# EAGLE design voice-rev.03 (EAGLE 6.5.0)
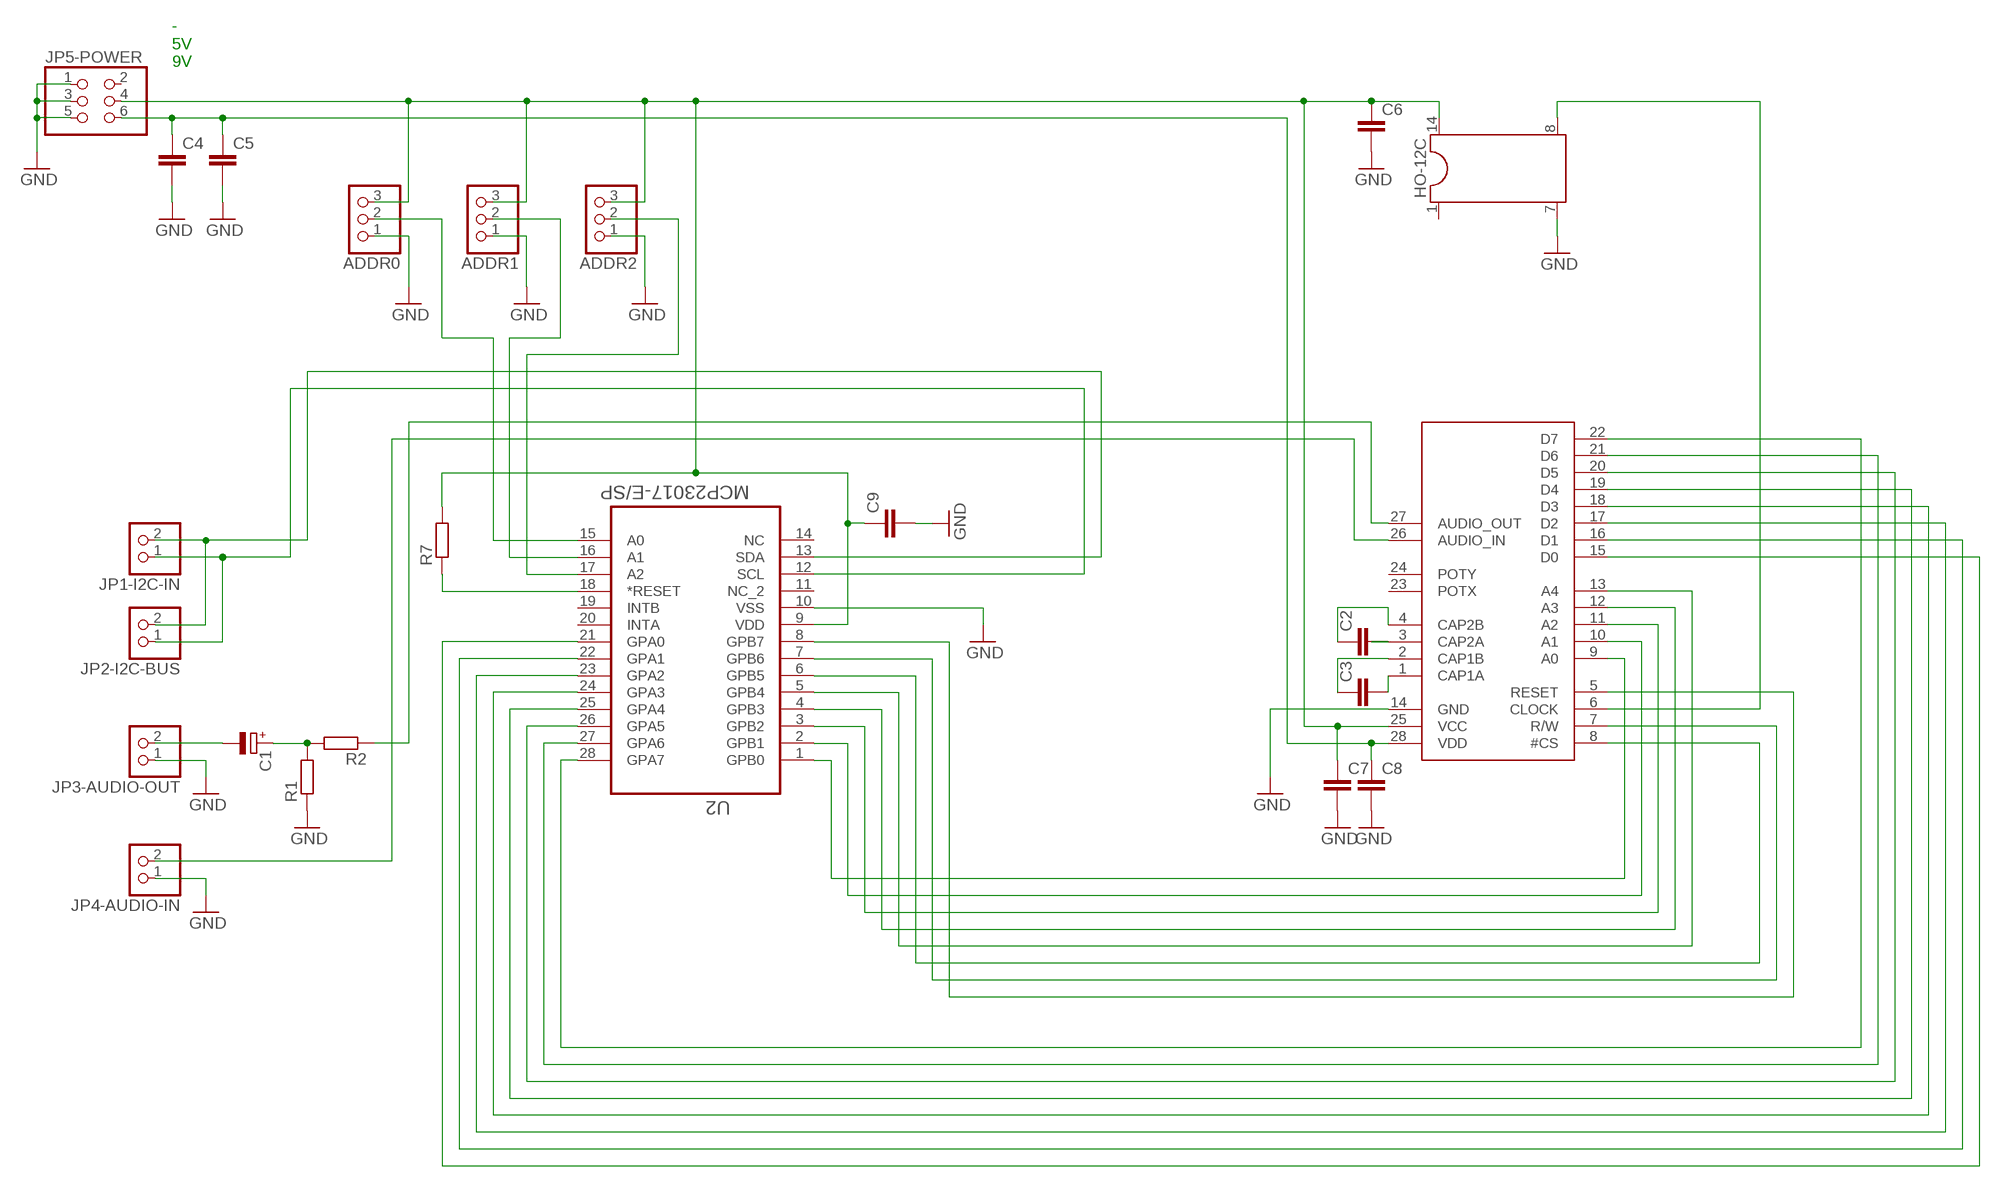
[diagram p0: schematic, sheet 1]

## Parts
ADDR0  PINHD-1X3  [1X03]
ADDR1  PINHD-1X3  [1X03]
ADDR2  PINHD-1X3  [1X03]
C1  CPOL-EUE2.5-5  [E2,5-5]
C2  C5/2.5  [C5B2.5]
C3  C5/2.5  [C5B2.5]
C4  C-EU050-024X044  [C050-024X044]
C5  C-EU050-024X044  [C050-024X044]
C6  C-EU050-024X044  [C050-024X044]
C7  C-EU050-024X044  [C050-024X044]
C8  C-EU050-024X044  [C050-024X044]
C9  C-EU050-024X044  [C050-024X044]
HO-12C  DIL14/4  [DIL14/4]
JP1-I2C-IN  PINHD-1X2  [1X02]
JP2-I2C-BUS  PINHD-1X2  [1X02]
JP3-AUDIO-OUT  PINHD-1X2  [1X02]
JP4-AUDIO-IN  PINHD-1X2  [1X02]
JP5-POWER  PINHD-2X3  [2X03]
R1  R-EU_0207/5V  [0207/5V]
R2  R-EU_0207/5V  [0207/5V]
R7  R-EU_0207/5V  [0207/5V]
U2  MCP23017-E/SP  [DIP254P762X406-28P]
U$1  6581  [DIL28-6]

## Nets
GND: ADDR0.1 ADDR1.1 ADDR2.1 C4.2 C5.2 C6.2 C7.2 C8.2 C9.2 HO-12C.7 JP3-AUDIO-OUT.1 JP4-AUDIO-IN.1 JP5-POWER.1 JP5-POWER.3 JP5-POWER.5 R1.1 U2.10(VSS) U$1.14(GND)
N$1: U2.1(GPB0) U$1.9(A0)
N$2: U2.2(GPB1) U$1.10(A1)
N$3: U2.3(GPB2) U$1.11(A2)
N$4: U2.4(GPB3) U$1.12(A3)
N$5: U2.5(GPB4) U$1.13(A4)
N$6: U2.6(GPB5) U$1.8(#CS)
N$7: U2.7(GPB6) U$1.7(R/W)
N$8: U2.8(GPB7) U$1.5(RESET)
N$9: U2.28(GPA7) U$1.22(D7)
N$10: U2.27(GPA6) U$1.21(D6)
N$11: U2.26(GPA5) U$1.20(D5)
N$12: U2.25(GPA4) U$1.19(D4)
N$13: U2.24(GPA3) U$1.18(D3)
N$14: U2.23(GPA2) U$1.17(D2)
N$15: U2.22(GPA1) U$1.16(D1)
N$16: U2.21(GPA0) U$1.15(D0)
N$17: HO-12C.8 U$1.6(CLOCK)
N$18: C1.+ R1.2 R2.2
N$20: C4.1 C5.1 C8.1 JP5-POWER.6 U$1.28(VDD)
N$21: R2.1 U$1.27(AUDIO_OUT)
N$22: JP4-AUDIO-IN.2 U$1.26(AUDIO_IN)
N$25: JP1-I2C-IN.2 JP2-I2C-BUS.2 U2.13(SDA)
N$26: JP1-I2C-IN.1 JP2-I2C-BUS.1 U2.12(SCL)
N$27: C1.- JP3-AUDIO-OUT.2
N$28: C3.2 U$1.1(CAP1A)
N$29: C3.1 U$1.2(CAP1B)
N$30: C2.2 U$1.3(CAP2A)
N$31: C2.1 U$1.4(CAP2B)
N$32: ADDR0.2 U2.15(A0)
N$33: ADDR1.2 U2.16(A1)
N$34: ADDR2.2 U2.17(A2)
N$36: R7.1 U2.18(*RESET)
N$39: ADDR0.3 ADDR1.3 ADDR2.3 C6.1 C7.1 C9.1 HO-12C.14 JP5-POWER.4 R7.2 U2.9(VDD) U$1.25(VCC)
Unconnected: HO-12C.1 JP5-POWER.2 U2.11(NC_2) U2.14(NC) U2.19(INTB) U2.20(INTA) U$1.23(POTX) U$1.24(POTY)

## Notes on the sheet
- -
  5V
  9V

## Library data of the parts
ADDR0 ADDR1 ADDR2 = pinhead:PINHD-1X3: PIN HEADER
C1 = resistor:CPOL-EU: POLARIZED CAPACITOR, European symbol
C2 C3 = capacitor-wima:C: CAPACITOR naming: grid - package width
C4-C9 = resistor:C-EU: CAPACITOR, European symbol
HO-12C = ic-package:DIL14/4: Dual In Line / Socket
JP1-I2C-IN JP2-I2C-BUS JP3-AUDIO-OUT JP4-AUDIO-IN = pinhead:PINHD-1X2: PIN HEADER
JP5-POWER = pinhead:PINHD-2X3: PIN HEADER
R1 R2 R7 = resistor:R-EU_: RESISTOR, European symbol
U2 = mcp23017-e-sp:MCP23017-E/SP: IC, 16-Bit I/O Expander with Serial Interface, DIP-28; MPN: MCP23017-E/SP; OC_FARNELL: 1332088; OC_NEWARK: 31K2959; PACKAGE: DIP-28; SUPPLIER: Microchip
U$1 = Mos6581_sid:6581: The Famous C64 Sound Chip - MOS6581

## Board
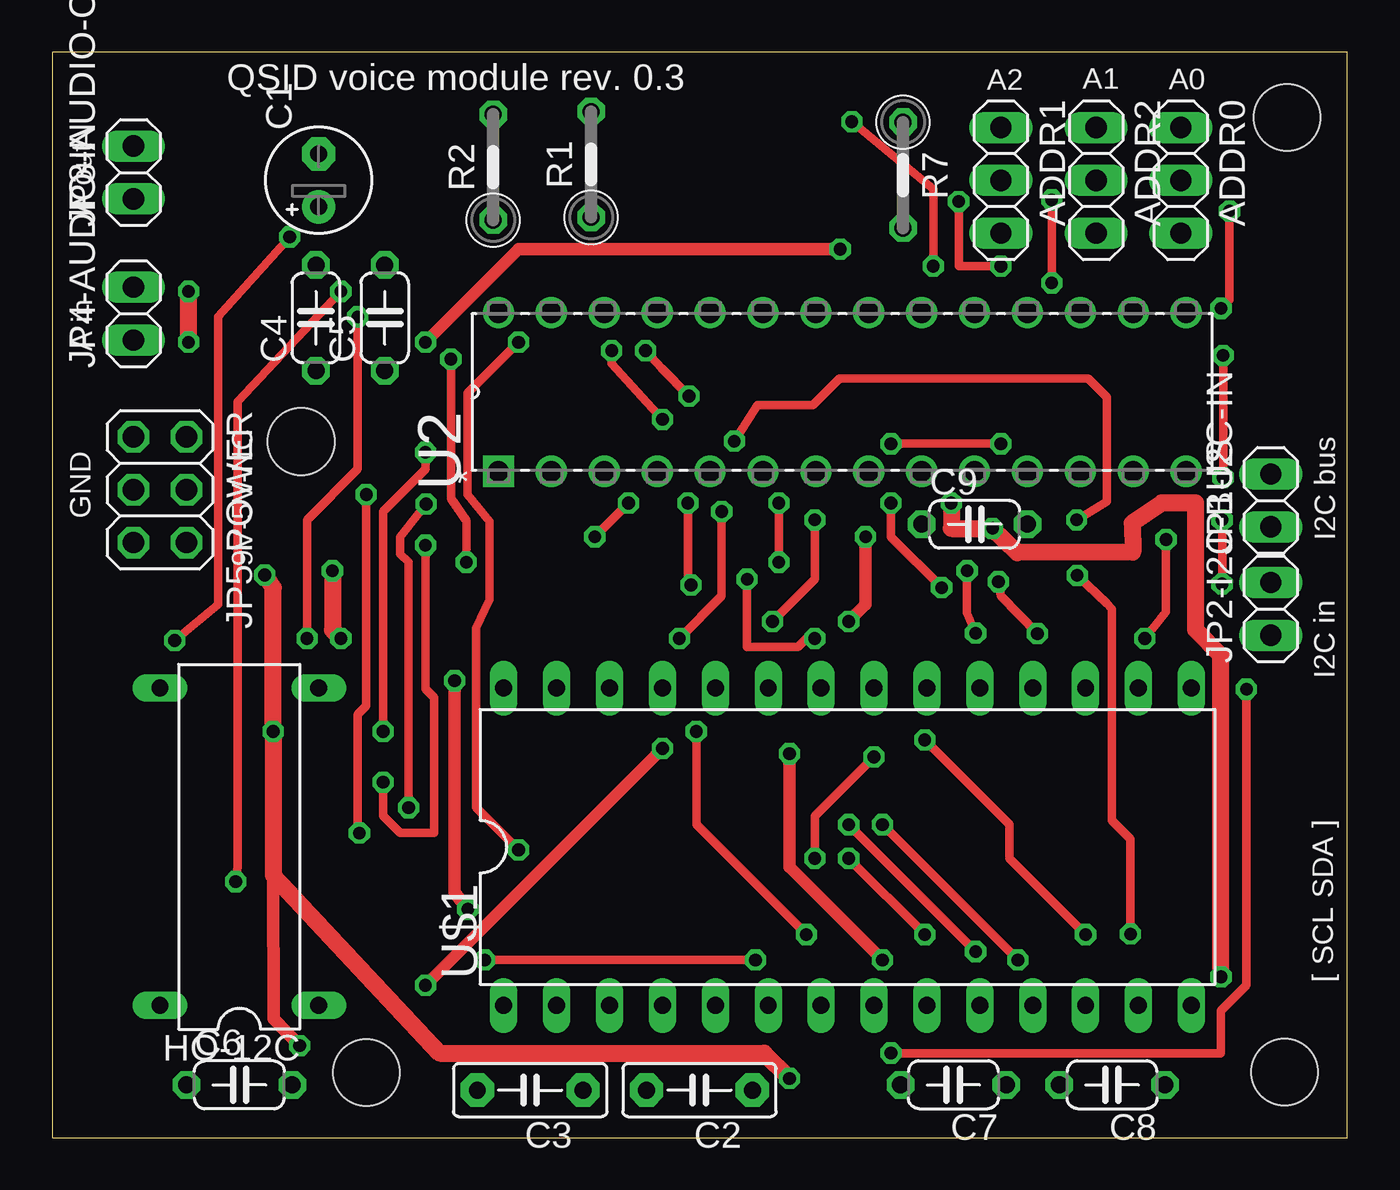
[diagram p1: board, top side]
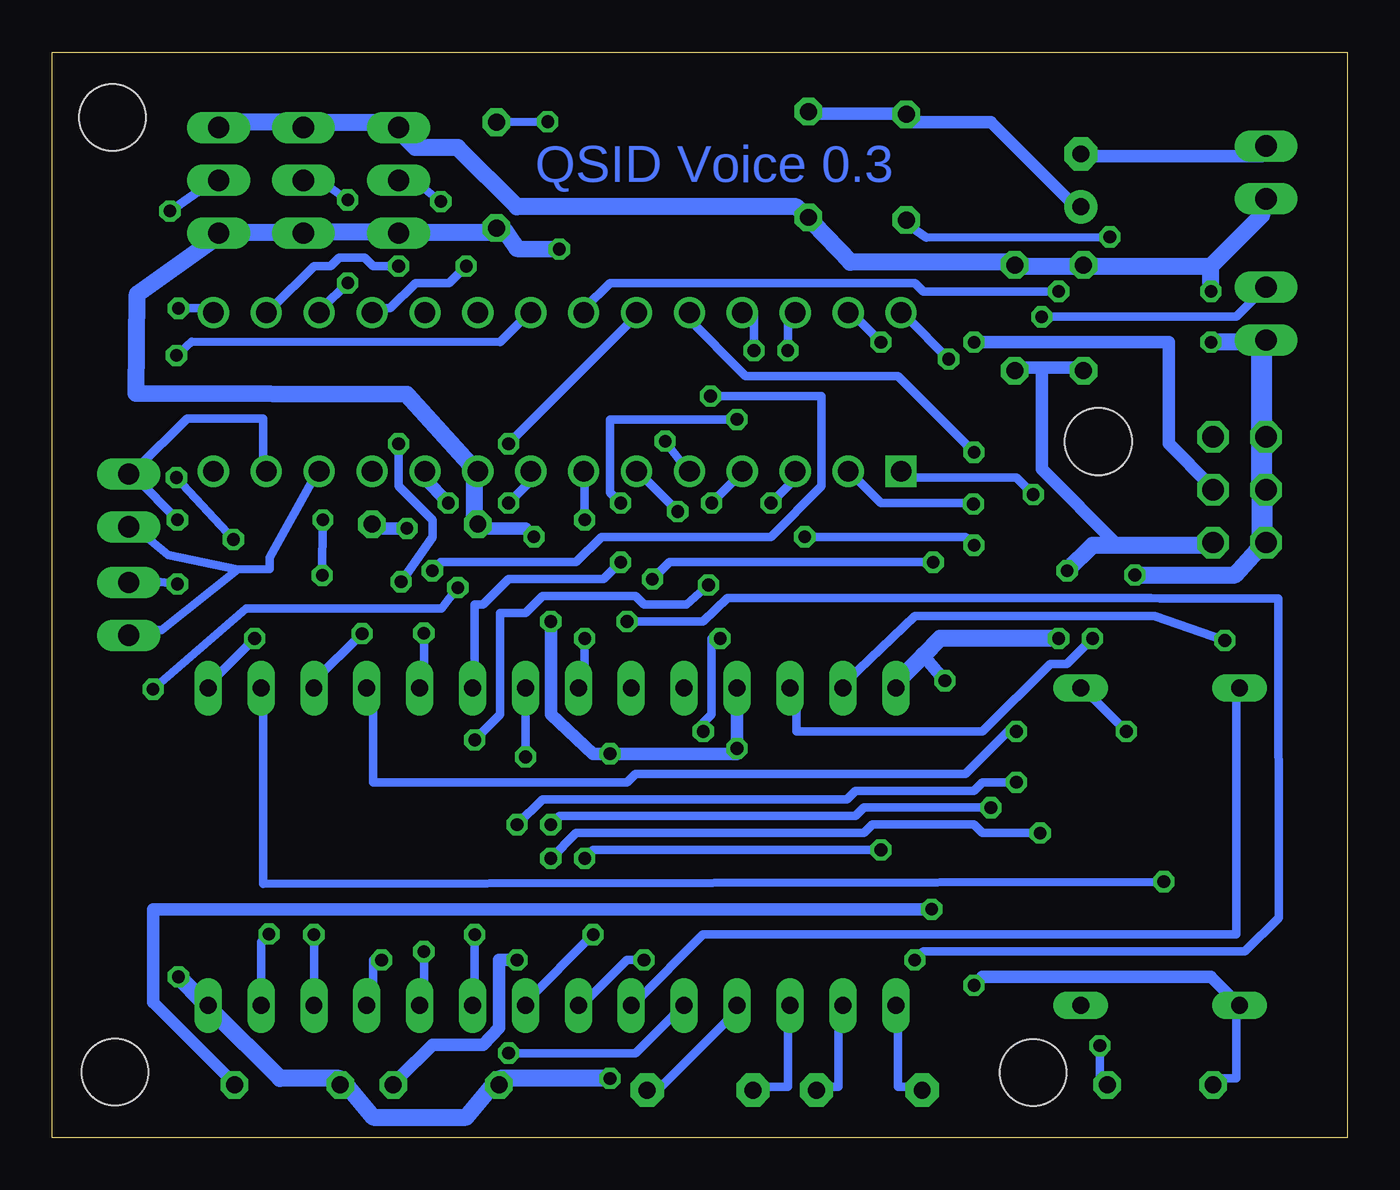
[diagram p2: board, bottom side, seen from below]

Size 62.2 x 52.14 mm. Coordinates in mm from the lower left corner, seen from the top.
Outline: 0,0 62.2,0 62.2,52.14 0,52.14 0,0
Copper layers (1*16): Top 0.035mm / dielectric 1.5mm / Bottom 0.035mm
Design rules "default *": minimum track width 16mil, minimum drill 24mil, track to track 12mil, track to pad 12mil, pad to pad 12mil, via to via 12mil, smd to smd 8mil, copper to edge 40mil, drill to drill 8mil, minimum pad ring 10mil, minimum via ring 8mil, stop-mask expansion 4mil, vias tented up to drill 0mil, thermal gap 10mil
Holes 3.2 mm at 15.09,3.12 11.96,33.43 59.31,49 59.18,3.15
tRestrict: area 43.8,47.8 to 47.3,49.3; area 40.1,47.8 to 41.9,49.8; area 40,42.4 to 42,44.7; area 3.7,20.3 to 7,22.9; area 11.3,20.6 to 14.6,22.9; area 3.4,5.1 to 7.2,7.4; area 11.3,5.3 to 14.3,7.1; area 5.4,1.5 to 7.5,3.6; area 10.5,1.5 to 12.5,3.6; area 39.5,1.3 to 41.8,3.6; area 44.8,1.5 to 46.8,3.6; area 47.3,1.5 to 49.4,3.6; 40 more areas

### Footprints (pad centres in the part's own frame; a part is rotated, then mirrored left to right if it is on the bottom)
1X03 = drill 1.016 long: 1 -2.54,0; 2 0,0; 3 2.54,0
E2,5-5 = drill 0.813 pad 1.6: + -1.27,0 | drill 0.813 pad 1.6 octagon: - 1.27,0
C5B2.5 = drill 0.813 pad 1.6 octagon: 1 -2.54,0; 2 2.54,0
C050-024X044 = drill 0.813 octagon: 1 -2.54,0; 2 2.54,0
DIL14/4 = drill 0.813 long: 1 -7.62,-3.81; 7 7.62,-3.81; 8 7.62,3.81; 14 -7.62,3.81
1X02 = drill 1.016 long: 1 -1.27,0; 2 1.27,0
2X03 = drill 1.016 octagon: 1 -2.54,-1.27; 2 -2.54,1.27; 3 0,-1.27; 4 0,1.27; 5 2.54,-1.27; 6 2.54,1.27
0207/5V = drill 0.813 octagon: 1 -2.54,0; 2 2.54,0
DIP254P762X406-28P = drill 0.991 square: 1 -7.62,33.02 | drill 0.991: 2 -7.62,30.48; 3 -7.62,27.94; 4 -7.62,25.4; 5 -7.62,22.86; 6 -7.62,20.32; 7 -7.62,17.78; 8 -7.62,15.24; 9 -7.62,12.7; 10 -7.62,10.16; 11 -7.62,7.62; 12 -7.62,5.08; 13 -7.62,2.54; 14 -7.62,0; 15 0,0; 16 0,2.54; 17 0,5.08; 18 0,7.62; 19 0,10.16; 20 0,12.7; 21 0,15.24; 22 0,17.78; 23 0,20.32; 24 0,22.86; 25 0,25.4; 26 0,27.94; 27 0,30.48; 28 0,33.02
DIL28-6 = drill 0.813 long: 1 -16.51,-7.62; 2 -13.97,-7.62; 3 -11.43,-7.62; 4 -8.89,-7.62; 5 -6.35,-7.62; 6 -3.81,-7.62; 7 -1.27,-7.62; 8 1.27,-7.62; 9 3.81,-7.62; 10 6.35,-7.62; 11 8.89,-7.62; 12 11.43,-7.62; 13 13.97,-7.62; 14 16.51,-7.62; 15 16.51,7.62; 16 13.97,7.62; 17 11.43,7.62; 18 8.89,7.62; 19 6.35,7.62; 20 3.81,7.62; 21 1.27,7.62; 22 -1.27,7.62; 23 -3.81,7.62; 24 -6.35,7.62; 25 -8.89,7.62; 26 -11.43,7.62; 27 -13.97,7.62; 28 -16.51,7.62

### Placement (x,y rotation side)
ADDR0  54.2,45.97 270 top
ADDR1  45.57,45.97 270 top
ADDR2  50.14,45.97 270 top
C1  12.8,45.97 90 top
C2  31.09,2.29 180 top
C3  22.96,2.29 180 top
C4  12.67,39.37 90 top
C5  15.98,39.37 90 top
C6  8.99,2.54 0 top
C7  43.28,2.54 180 top
C8  50.9,2.54 180 top
C9  44.3,29.46 0 top
HO-12C  8.99,13.97 90 top
JP1-I2C-IN  58.52,30.61 90 top
JP2-I2C-BUS  58.52,25.4 90 top
JP3-AUDIO-OUT  3.91,46.35 90 top
JP4-AUDIO-IN  3.91,39.57 90 top
JP5-POWER  5.18,31.11 270 top
R1  25.88,46.74 90 top
R2  21.18,46.61 90 top
R7  40.87,46.23 270 top
U2  54.46,39.62 90 top
U$1  38.2,13.97 0 top

### Tracks (layer width: path | path; a pad name or v marks a point on that pad's centre or on a via)
GND  (via drill 0.61)
  Top 0.61: v11.89,4.42 10.64,5.71 10.62,12.6
  Top 0.813: v43.18,30.48 43.18,29.26 v45.16,29.26 46.35,28.09 51.89,28.12 51.87,29.52 53.29,30.48 54.91,30.48 54.91,24.38 56.13,23.16 v56.13,7.72 | v10.21,27.03 10.62,26.42 v10.62,19.51 10.62,12.6 18.62,4.06 34.19,4.06 v35.41,2.85 | v6.55,38.2 v6.55,40.64
  Bottom 0.406: 45.57,48.77 ADDR1.1 45.57,48.36 | 50.44,48.77 ADDR2.1 | 13.06,41.86 C4.2 12.65,41.86 | 15.9,41.86 C5.2 16.15,42.04 | 26.06,44.3 R1.1 | 46.79,29.26 C9.2 | 44.35,31.7 U2.10 | 48.01,2.44 C8.2 48.41,2.85 | 54.51,6.1 U$1.14 | 4.11,28.85 JP5-POWER.5 | 4.11,30.89 JP5-POWER.3 4.11,31.29 | 4.11,33.33 JP5-POWER.1 4.11,33.73 | 4.11,37.8 JP4-AUDIO-IN.1 | v11.89,4.42 11.89,2.79 C6.2 | v10.62,19.51 12.65,21.54 HO-12C.7
  Bottom 0.61: v45.16,29.26 46.79,29.26 | 44.35,31.7 v43.18,30.48 | 41.1,2.44 C7.2 40.69,2.85 | 54.91,6.5 U$1.14
  Bottom 0.813: 45.57,48.77 50.04,48.77 ADDR2.1 | 50.44,48.77 54.1,48.77 ADDR0.1 | 15.9,41.86 13.06,41.86 | 16.15,42.04 23.88,42.04 25.65,43.89 R1.1 | 6.55,41.86 4.11,44.3 JP3-AUDIO-OUT.1 | 12.65,41.86 6.55,41.86 | 45.57,48.36 44.75,47.55 42.72,47.55 39.88,44.7 26.47,44.7 26.06,44.3 | 41.1,2.44 42.32,0.99 46.79,0.99 48.01,2.44 | 54.51,6.1 51.26,2.85 48.41,2.85 | 54.91,6.5 v56.13,7.72 | v10.21,27.03 5.38,27.03 4.11,28.45 JP5-POWER.5 | v35.41,2.85 40.69,2.85 | v6.55,40.64 6.55,41.86 | v6.55,38.2 4.11,38.2 JP4-AUDIO-IN.1
  Bottom 1.016: 4.11,30.89 4.11,28.85 | 4.11,31.29 4.11,33.33 | 4.11,33.73 4.11,37.8
N$1  (via drill 0.61)
  Top 0.406: v38.25,13.41 v41.91,9.75 | v14.76,14.63 14.68,15.04 14.68,20.32 15.09,20.73 v15.09,30.89
  Bottom 0.406: v41.91,9.75 41.91,6.5 U$1.9 | v38.25,13.41 37.03,14.63 23.22,14.63 22.81,15.04 17.93,15.04 17.53,14.63 v14.76,14.63 | v15.09,30.89 15.9,31.7 21.18,31.7 U2.1
N$2  (via drill 0.61)
  Top 0.406: v38.25,15.04 v44.35,8.94 | v17.12,15.85 17.12,27.64 16.71,28.04 16.71,28.85 v17.96,30.43
  Bottom 0.406: v44.35,8.94 44.35,6.5 U$1.10 | v38.25,15.04 37.85,15.44 23.62,15.44 23.22,15.85 v17.12,15.85 | v17.96,30.43 18.34,30.48 22.4,30.48 23.62,31.7 U2.2
N$3  (via drill 0.61)
  Top 0.406: v39.88,15.04 v46.38,8.53 | v15.9,17.07 15.9,15.44 16.71,14.63 18.34,14.63 18.34,21.13 17.93,21.54 v17.93,28.45 | v27.69,30.48 v26.06,28.85
  Bottom 0.406: v46.38,8.53 46.79,8.53 46.79,6.5 U$1.11 | v39.88,15.04 38.66,16.26 24.03,16.26 23.62,16.66 17.93,16.66 17.53,17.07 v15.9,17.07 | v17.93,28.45 18.34,28.85 v26.06,28.85 | v27.69,30.48 26.47,31.7 U2.3
N$4  (via drill 0.61)
  Top 0.406: v49.63,9.75 45.97,13.41 45.97,15.04 v41.91,19.1 | v30.68,26.54 30.53,26.82 v30.53,30.48
  Bottom 0.406: v49.63,9.75 U$1.12 | v41.91,19.1 40.69,20.32 40.69,25.2 39.47,25.2 38.66,26.01 34.19,26.01 33.78,25.6 31.75,25.6 v30.68,26.54 | v30.53,30.48 29.31,31.7 U2.4
N$5  (via drill 0.6)
  Top 0.406: v32.77,33.45 33.88,35.18 36.55,35.18 37.82,36.45 49.76,36.45 50.65,35.56 50.65,30.56 v49.2,29.67 | v51.79,9.78 51.79,14.35 50.9,15.24 50.9,25.4 50.65,25.65 v49.23,27
  Bottom 0.406: U2.5 31.85,32.26 v32.77,33.45 | v51.79,9.78 52.17,9.4 U$1.13 | v49.2,29.67 v49.23,27
N$6  (via drill 0.61)
  Top 0.406: v36.22,9.75 30.94,15.04 v30.94,19.51 | v30.12,23.98 32.16,26.01 v32.16,30.07
  Bottom 0.406: v36.22,9.75 39.47,6.5 U$1.8 | v30.94,19.51 30.94,19.91 30.53,20.32 30.53,23.98 v30.12,23.98 | v32.16,30.07 33.78,31.7 U2.6
N$7  (via drill 0.61)
  Top 0.406: v20.78,8.53 v33.78,8.53 | v34.59,24.79 36.63,26.82 v36.63,29.67
  Bottom 0.406: v33.78,8.53 34.59,8.53 36.63,6.5 U$1.7 | v20.78,8.53 20.37,8.94 4.93,8.94 3.3,10.57 3.33,25.88 9.02,25.88 9.45,25.91 29.77,25.91 30.94,24.79 v34.59,24.79 | v36.63,29.67 36.63,31.7 U2.7
N$8  (via drill 0.61)
  Top 0.406: v40.28,4.06 56.13,4.06 56.13,6.1 57.35,7.32 v57.35,21.54 | v42.72,26.42 40.28,28.85 v40.28,30.48
  Bottom 0.406: v40.28,4.06 34.19,4.06 32.16,6.1 U$1.5 | v57.35,21.54 52.88,25.43 43.51,25.43 v42.72,26.42 | v40.28,30.48 39.07,31.7 U2.8
N$9  (via drill 0.61)
  Top 0.406: v36.63,23.98 36.22,23.98 35.81,23.57 33.38,23.57 v33.38,26.82 | v19.15,37.39 19.15,30.68 19.91,29.62 19.91,28.75 v19.89,27.64
  Bottom 0.406: v36.63,23.98 36.63,21.95 U$1.22 | v33.38,26.82 32.56,27.64 v19.89,27.64 | v19.15,37.39 21.18,39.42 U2.28
N$10  (via drill 0.61)
  Top 0.406: v39.47,18.29 36.63,15.44 v36.63,13.41 | v22.4,13.82 20.37,15.85 20.37,24.49 21.01,25.86 21.01,29.59 19.96,30.89 19.96,35.76 v22.4,38.2
  Bottom 0.406: v39.47,18.29 U$1.21 | v36.63,13.41 36.22,13.82 v22.4,13.82 | v22.4,38.2 23.62,39.42 U2.27
N$11  (via drill 0.61)
  Top 0.406: v34.9,30.48 v34.9,27.64 | v29.31,34.49 26.87,37.19 v26.87,37.8
  Bottom 0.406: v34.9,27.64 35.71,26.82 40.28,26.82 41.5,25.6 41.91,25.6 41.91,21.95 U$1.20 | v34.9,30.48 35.41,30.99 35.41,34.49 v29.31,34.49 | v26.87,37.8 26.87,39.42 U2.26
N$12  (via drill 0.61)
  Top 0.406: v44.35,24.23 43.94,25.2 v43.94,27.23 | v30.58,35.61 29.26,36.96 v28.5,37.8
  Bottom 0.406: v44.35,24.23 44.35,21.95 U$1.19 | v43.94,27.23 43.54,27.64 37.03,27.64 35.81,28.85 27.69,28.85 25.25,31.29 25.25,35.61 v30.58,35.61 | v28.5,37.8 28.5,39.42 28.91,39.42 U2.25
N$13  (via drill 0.61)
  Top 0.406: v15.9,19.51 15.9,30.07 17.93,32.11 v17.93,32.92
  Bottom 0.406: v15.9,19.51 16.31,19.51 18.34,17.48 34.19,17.48 34.59,17.07 46.79,17.07 46.79,21.54 U$1.18 | v17.93,32.92 21.59,36.58 28.91,36.58 31.75,39.42 U2.24
N$14  (via drill 0.61)
  Top 0.406: v47.32,24.21 45.57,26.01 v45.44,26.7 | v40.28,33.33 v45.57,33.33
  Bottom 0.406: v47.32,24.21 49.63,21.95 U$1.17 | v45.44,26.7 43.94,28.85 43.94,29.67 45.57,31.29 v45.57,33.33 | v40.28,33.33 34.19,39.42 U2.23
N$15  (via drill 0.61)
  Top 0.406: v8.81,12.29 8.92,13.01 8.92,35.36 v13.87,40.64
  Bottom 0.406: v8.81,12.29 52.07,12.19 52.07,21.54 U$1.16 | v13.87,40.64 20.37,40.64 20.78,41.05 35.41,41.05 36.63,39.83 U2.22
N$16  (via drill 0.61)
  Top 0.406: v52.48,23.98 53.49,25.25 v53.49,28.73 | v56.24,37.57 v56.24,31.7
  Bottom 0.406: v52.48,23.98 54.51,21.95 U$1.15 | v56.24,31.7 v53.49,28.73 | v56.24,37.57 55.5,38.23 40.69,38.2 39.47,39.42 U2.21
N$17
  Bottom 0.406: HO-12C.8 5.33,21.54 5.33,9.75 30.94,9.75 34.19,6.5 U$1.6
N$18
  Bottom 0.406: 21.18,49.17 R2.2
  Bottom 0.61: 21.18,49.17 25.65,49.17 R1.2 | 13.06,44.7 17.12,48.77 21.18,48.77 R2.2
  Bottom 0.813: 13.06,44.7 C1.+
N$20  (via drill 0.61)
  Top 0.61: v19.96,10.97 19.33,11.79 v19.33,21.95
  Top 0.813: v13.87,23.98 13.46,24.38 v13.46,27.23
  Bottom 0.406: 6.55,28.45 JP5-POWER.6
  Bottom 0.61: 14.68,36.98 15.9,36.98 C5.1 | 14.68,36.98 13.06,36.98 C4.1 | v19.96,10.97 57.35,10.97 57.35,6.5 53.7,2.85 C8.1 | 20.37,23.16 v19.33,21.95 | 14.68,36.98 14.68,32.11 11.02,28.45
  Bottom 0.813: v13.87,23.98 19.56,23.98 20.37,23.16 21.59,21.95 U$1.28 | v13.46,27.23 12.24,28.45 11.02,28.45 6.55,28.45
N$21  (via drill 0.61)
  Top 0.406: v11.4,43.26 7.98,39.42 7.98,25.6 v5.89,23.88
  Bottom 0.406: v11.4,43.26 20.22,43.23 21.18,43.89 R2.1 | v5.89,23.88 9.27,25.04 20.78,25.04 24.03,21.95 U$1.27
N$22  (via drill 0.61)
  Top 0.406: v12.24,23.98 12.24,29.67 14.68,32.11 v14.68,39.42
  Bottom 0.406: v12.24,23.98 13.46,22.76 14.27,22.76 17.53,19.51 26.47,19.51 26.47,21.54 U$1.26 | v14.68,39.42 5.33,39.42 JP4-AUDIO-IN.2
N$25  (via drill 0.61)
  Top 0.406: v56.18,29.67 v56.18,26.59
  Bottom 0.406: U2.13 52.07,32.11 52.07,34.54 55.73,34.54 58.17,32.11 JP1-I2C-IN.2 58.17,31.7 v56.18,29.67 | v56.18,26.59 58.17,26.82 JP2-I2C-BUS.2
N$26
  Bottom 0.406: 53.29,27.28 56.95,24.38 58.17,24.38 JP2-I2C-BUS.1 | 53.29,27.28 51.77,27.3 51.77,27.86 49.63,31.7 U2.12 | 53.29,27.28 56.62,27.99 58.17,29.26 JP1-I2C-IN.1
N$27
  Bottom 0.61: JP3-AUDIO-OUT.2 4.11,47.14 12.65,47.14 C1.-
N$28
  Bottom 0.406: U$1.1 21.59,6.1 21.59,2.44 20.78,2.44 C3.2
N$29
  Bottom 0.406: U$1.2 24.43,6.1 24.43,2.44 25.25,2.44 C3.1
N$30
  Bottom 0.406: U$1.3 26.87,6.1 26.87,2.44 28.5,2.44 C2.2
N$31
  Bottom 0.406: U$1.4 29.31,6.1 32.97,2.44 33.38,2.44 C2.1
N$32  (via drill 0.61)
  Top 0.406: v56.13,39.83 56.54,40.23 v56.54,44.5
  Bottom 0.406: v56.13,39.83 54.51,39.83 U2.15 | v56.54,44.5 54.51,45.92 ADDR0.2
N$33  (via drill 0.61)
  Top 0.406: v45.57,41.86 43.54,41.86 v43.54,44.96
  Bottom 0.406: v45.57,41.86 46.79,41.86 47.19,42.27 48.41,42.27 48.82,41.86 49.63,41.86 51.66,39.83 U2.16 | v43.54,44.96 44.75,45.92 45.57,45.92 ADDR1.2
N$34  (via drill 0.61)
  Top 0.406: v48.01,45.03 v48.01,41.05
  Bottom 0.406: v48.01,41.05 49.23,39.83 U2.17 | v48.01,45.03 49.23,45.92 50.04,45.92 ADDR2.2
N$36  (via drill 0.61)
  Top 0.406: v38.4,48.79 42.32,45.54 v42.32,41.86
  Bottom 0.406: v38.4,48.79 40.69,48.77 R7.1 | v42.32,41.86 43.13,41.05 44.75,41.05 45.97,39.83 46.79,39.83 U2.18
N$39  (via drill 0.61)
  Top 0.61: v17.93,38.2 22.4,42.67 v37.85,42.67 | v38.25,24.79 39.07,25.6 v39.07,28.85 | v39.88,8.53 35.41,13.01 v35.41,18.44 | v29.31,18.69 v17.93,7.32
  Bottom 0.406: 50.44,43.48 ADDR2.3 50.04,43.48 | 41.1,43.48 R7.2 40.69,43.89 | 6.55,31.29 JP5-POWER.4 | 45.57,43.48 ADDR1.3 | HO-12C.14 5.33,6.1 5.33,2.85 6.15,2.85 C6.1 | 29.31,18.44 v29.31,18.69 | 41.91,31.7 U2.9 41.91,32.11 | 41.91,29.67 C9.1 | 54.51,43.08 ADDR0.3
  Bottom 0.61: 6.55,31.29 8.59,33.33 8.59,38.2 v17.93,38.2 | v29.31,18.69 U$1.25 | 29.31,18.44 v35.41,18.44 36.22,18.44 38.25,20.32 v38.25,24.79 | v39.07,28.85 39.47,29.26 41.5,29.26 C9.1 | v39.88,8.53 40.74,8.53 40.74,5.28 41.5,4.47 43.94,4.47 45.57,2.85 C7.1 | HO-12C.14 6.55,7.72 17.53,7.72 v17.93,7.32
  Bottom 0.813: 50.44,43.48 54.1,43.48 ADDR0.3 | 41.1,43.48 45.57,43.48 50.04,43.48 | v37.85,42.67 39.88,42.7 40.69,43.89 | 41.91,29.67 41.91,31.7 | 54.51,43.08 58.12,40.51 58.17,35.74 45.16,35.69 41.91,32.11

### Text on the board
Bottom: QSID Voice 0.3
tPlace: QSID voice module rev. 0.3 | A2 | A1 | A0 | A out | A in | GND | I2C bus | 9V-5V-NC | I2C in | [ SCL SDA ]